# EAGLE schematic 555 ping pong balls (EAGLE 5.06)
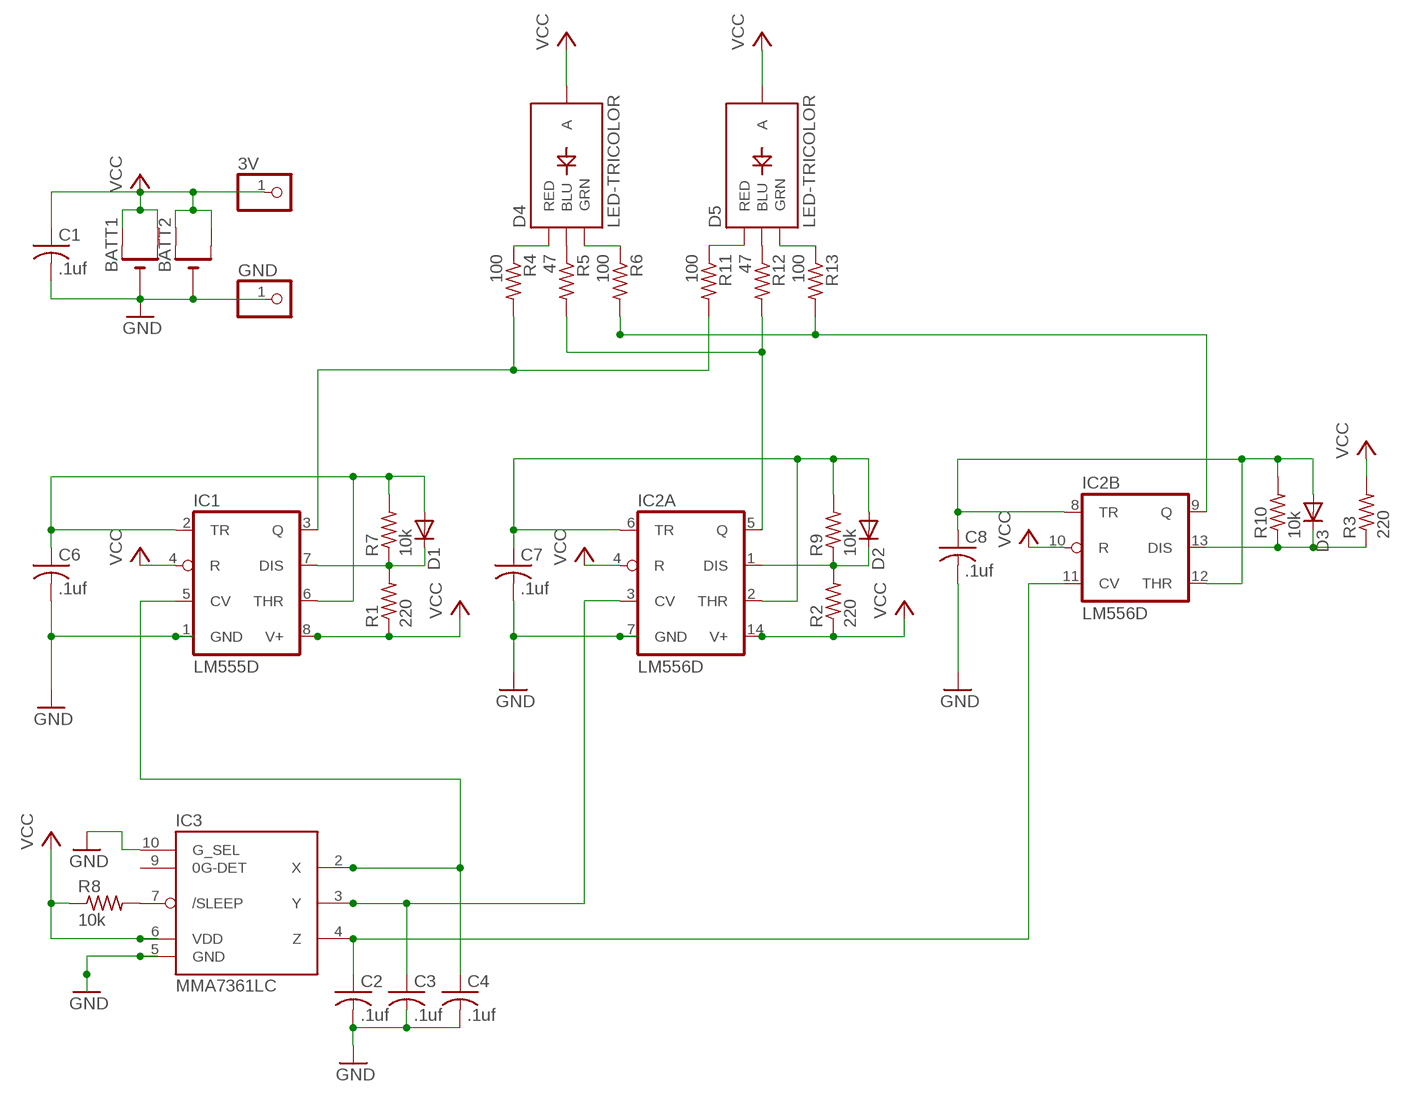
[diagram p0: schematic, sheet 1]

## Parts
3V  PINHD-1X1  [1X01]
BATT1  CR2032  [CR2032-SMD]
BATT2  CR2032  [CR2032-SMD]
C1  .1uf  C-USC0603  [C0603]
C2  .1uf  C-USC0603  [C0603]
C3  .1uf  C-USC0603  [C0603]
C4  .1uf  C-USC0603  [C0603]
C6  .1uf  C-USC0603  [C0603]
C7  .1uf  C-USC0603  [C0603]
C8  .1uf  C-USC0603  [C0603]
D1  DIODE-SOD110-R  [SOD110-R]
D2  DIODE-SOD110-R  [SOD110-R]
D3  DIODE-SOD110-R  [SOD110-R]
D4  LED-TRICOLOR  LED-TRICOLORTH  [LED-TRICOLOR-THROUGHHOLE]
D5  LED-TRICOLOR  LED-TRICOLORTH  [LED-TRICOLOR-THROUGHHOLE]
GND  PINHD-1X1  [1X01]
IC1  LM555D  [SO08]
IC2  LM556D  [SO14]
IC3  MMA7361LC  MMA7260/MMA7261LGA14  [LGA14]
R1  220  R-US_R0603  [R0603]
R2  220  R-US_R0603  [R0603]
R3  220  R-US_R0603  [R0603]
R4  100  R-US_R0603  [R0603]
R5  47  R-US_R0603  [R0603]
R6  100  R-US_R0603  [R0603]
R7  10k  R-US_R0603  [R0603]
R8  10k  R-US_R0603  [R0603]
R9  10k  R-US_R0603  [R0603]
R10  10k  R-US_R0603  [R0603]
R11  100  R-US_R0603  [R0603]
R12  47  R-US_R0603  [R0603]
R13  100  R-US_R0603  [R0603]

## Nets
N$1: D4.GRN R6.1
N$2: C2.1 IC2.11(B:CV) IC3.4(Z)
N$3: C3.1 IC2.3(A:CV) IC3.3(Y)
N$4: D1.C IC1.7(DIS) R1.2 R7.1
N$5: C6.1 D1.A IC1.2(TR) IC1.6(THR) R7.2
N$6: C7.1 D2.A IC2.2(A:THR) IC2.6(A:TR) R9.2
N$7: C8.1 D3.A IC2.8(B:TR) IC2.12(B:THR) R10.2
N$8: C4.1 IC1.5(CV) IC3.2(X)
N$9: D3.C IC2.13(B:DIS) R3.1 R10.1
N$10: D4.BLU R5.1
N$11: D5.BLU R12.1
N$12: D4.RED R4.1
N$14: IC2.5(A:Q) R5.2 R12.2
N$16: IC3.7(/SLEEP) R8.2
N$17: D2.C IC2.1(A:DIS) R2.2 R9.1
N$18: D5.GRN R13.1
N$19: D5.RED R11.1
N$20: BATT1.- BATT2.- C1.2 C2.2 C3.2 C4.2 C6.2 C7.2 C8.2 GND.1 IC1.1(GND) IC2.7(A:GND) IC3.5(GND) IC3.10(G_SEL) ; supply symbol labelled GND
N$21: IC2.9(B:Q) R6.2 R13.2
N$22: IC1.3(Q) R4.2 R11.2
N$31: 3V.1 BATT1.+$1(+) BATT1.+$2(+1) BATT2.+$1(+) BATT2.+$2(+1) C1.1 D4.COMMON(A) D5.COMMON(A) IC1.4(R) IC1.8(V+) IC2.4(A:R) IC2.10(B:R) IC2.14(A:V+) IC3.6(VDD) R1.1 R2.1 R3.2 R8.1 ; supply symbol labelled VCC
Unconnected: IC3.9(0G-DET)

## Library data of the parts
3V GND = digg:PINHD-1X1: PIN HEADER
BATT1 BATT2 = digg:CR2032
C1-C4 C6-C8 = rcl:C-US: CAPACITOR, American symbol
D1-D3 = diode:DIODE-: DIODE
D4 D5 = SYNShop:LED-TRICOLOR: Tri-Color LED SMD Proven layout and schematic for triple color LED in SMD package - common anode. Spark Fun Electronics SKU : COM-07844
IC1 = linear:*555: TIMER
IC2 = linear:*556: Dual TIMER
IC3 = mma7260_7261:MMA7260/MMA7261
R1-R13 = rcl:R-US_: RESISTOR, American symbol